# EasyEDA Pro project ProPrj_英才杯B题_2024-11-06.epro, board PCB1
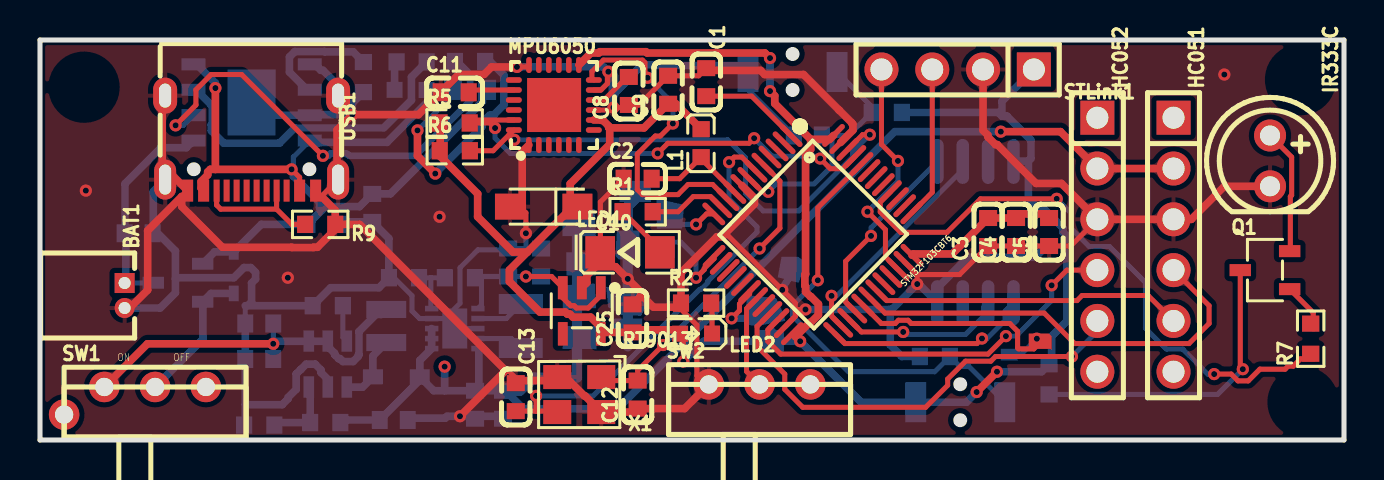
[diagram p1: board, top side]
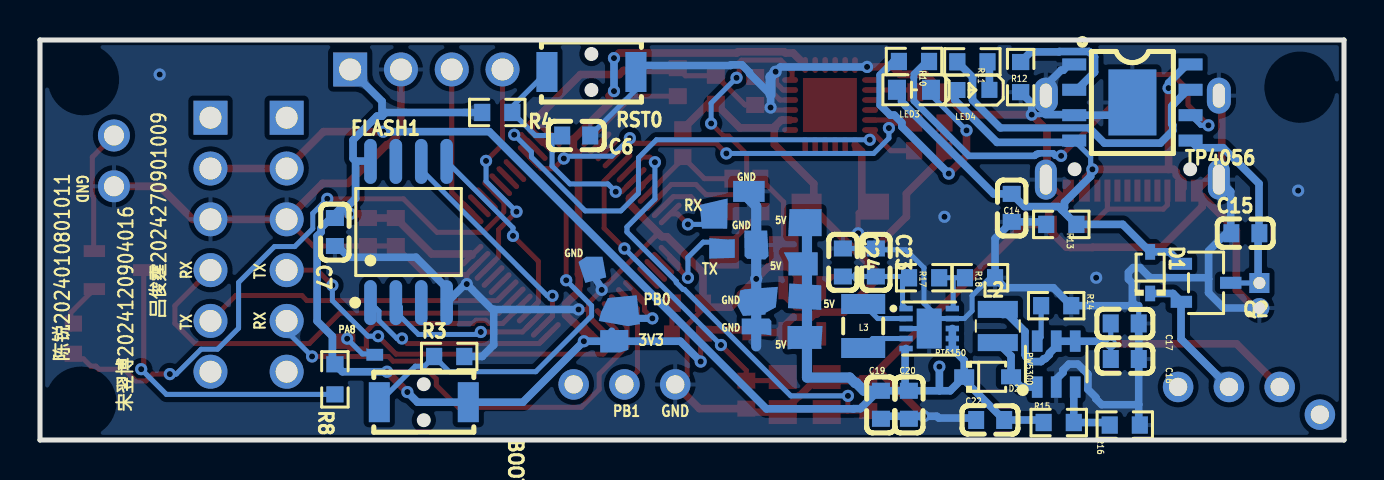
[diagram p2: board, bottom side, seen from below]

Outline 65.21 x 20 mm; copper layers: Top Layer, Bottom Layer. Coordinates in mm from the lower left corner of the outline.
Outline path: 0,20 0,0 65.21,0 65.21,20 0,20
Stack: Top Layer 0.035mm / Dielectric1 1.51mm FR4 er 4.5 / Bottom Layer 0.035mm

## Design rules (mm)
template: JLCPCB Capability(Two Layers Board)
spacing copperThickness1oz (default): track to track 0.102, other pairs 0.152 to 0.3
spacing copperThickness2oz: track to track 0.203, other pairs 0.152 to 0.3
track width copperThickness1oz (default): min 0.127, default 0.254, max 2.54
track width copperThickness2oz: min 0.203, default 0.254, max 2.54
differential pair differentialPair (default): width min 0.127, default 0.254, max 2.54; gap min 0.152, default 0.152
via viaSize (default): diameter min 0.5, default 0.61, max 10; hole min 0.3, default 0.305, max 6.3

## Placement (name value [footprint] x y rotation side)
BAT1  HC-1.25-2AW  [CONN-TH_2P-P1.25_HCTL_HC-1.25-2AW]  4.23 7.22 270 top
BOOT0  ZX-QC34-2TPDZ  [KEY-SMD_L3.9-W3.0-LS5.0-EH]  46.02 1.89 180 bottom
C1  100nF  [C0603]  33.32 17.89 270 top
C2  100nF  [C0603]  29.89 13.07 0 top
C3  100nF  [C0603]  47.41 10.4 90 top
C4  100nF  [C0603]  48.81 10.4 90 top
C5  100nF  [C0603]  50.46 10.4 90 top
C6  100nF  [C0603]  38.39 15.22 0 bottom
C7  100nF  [C0603]  50.46 10.4 90 bottom
C8  100nF  [C0603]  29.44 17.45 90 top
C9  10nF  [C0603]  31.41 17.51 90 top
C10  100nF  [CAP-SMD_L3.2-W1.6-RD]  25.19 11.67 180 top
C11  2.2uF  [C0603]  20.74 17.38 0 top
C12  12pF  [C0603]  29.89 2.27 90 top
C13  12pF  [C0603]  23.79 2.14 270 top
C14  10uF  [C0603]  16.62 11.61 90 bottom
C15  10uF  [C0603]  4.93 10.34 180 bottom
C16  100nF  [C0603]  10.96 4.05 0 bottom
C17  22uF  [C0603]  10.97 5.83 0 bottom
C19  100nF  [C0603]  23.16 1.76 90 bottom
C20  22uF  [C0603]  21.76 1.76 90 bottom
C22  10uF  [C0603]  17.69 1 180 bottom
C23  22uF  [C0603]  23.41 8.88 270 bottom
C24  1uF  [C0603]  25.06 8.88 270 bottom
C25  1uF  [C0603]  29.63 6.08 90 top
D1  B5817WS  [SOD-323_L1.7-W1.3-LS2.5-FD]  9.69 8.37 270 bottom
D2  1N5819WS  [SOD-323_L1.8-W1.3-LS2.5-RD]  17.82 3.16 180 bottom
FLASH1  W25Q16JVSSIQ  [SOIC-8_L5.3-W5.3-P1.27-LS8.0-BL]  46.78 10.4 180 bottom
HC051  PZ254V-11-06P  [HDR-TH_6P-P2.54-V-M]  56.68 9.76 270 top
HC052  PZ254V-11-06P  [HDR-TH_6P-P2.54-V-M]  52.87 9.76 270 top
IR333C  IR333C-A(BY)(Q)  [LED-TH_BD5.0-P2.54-FD]  61.51 13.95 270 top
L1  CBG160808U000T  [L0603]  33.06 14.84 90 top
L2  3.3uH  [IND-SMD_L2.5-W2.0-VLS252012CX-150M]  17.31 5.7 270 bottom
L3  2.2uH  [IND-SMD_L2.5-W2.0_MHCHL2520]  24.04 5.7 90 bottom
LED1  NCD1206R1  [LED1206-R-RD_RED]  29.51 9.38 0 top
LED2  NCD0603R1  [LED0603-RD_RED]  32.81 5.32 180 top
LED3  NCD0603G1  [led0603-rd_1]  21.5 17.51 0 bottom
LED4  NCD0603R1  [LED0603-RD_RED]  18.53 17.5 0 bottom
MPU6050  MPU-6050  [QFN-24_L4.0-W4.0-P0.50-BL-EP2.7]  25.7 16.75 0 top
NOREF  -  [Pad_e13908]  26.96 10.87 0 top
NOREF#2  -  [Pad_e95]  37.59 8.56 0 top
NOREF#3  -  [Pad_e96]  36.24 6.46 0 top
NOREF#4  -  [Pad_e13905]  27.17 8.8 0 top
NOREF#5  -  [Pad_e13907]  26.95 5.13 0 top
NOREF#6  -  [Pad_e13909]  29.32 6.91 0 top
NOREF#7  -  [Pad_e13888]  31.5 11.32 0 top
NOREF#8  -  [Pad_e164]  1.21 1.27 0 top
NOREF#9  -  [Pad_e13910]  29.38 5.68 0 top
NOREF#10  -  [Pad_e13924]  29.76 12.43 0 top
NOREF#11  -  [Pad_e13889]  31.1 9.57 0 top
NOREF#12  -  [Pad_e13922]  29.39 9.75 0 top
NOREF#13  -  [Pad_e575]  49.96 4.94 0 top
NOREF#14  -  [Pad_e97]  36.49 4.94 0 top
NOREF#15  -  [Pad_e881]  48.47 4.26 0 top
NOREF#16  -  [Pad_e13906]  26.97 7.17 0 top
PW5300  PW5300  [SOT-23-6_L2.9-W1.6-P0.95-LS2.8-BL]  14.39 3.8 180 bottom
Q1  S8050  [SOT-23-3_L2.9-W1.6-P1.90-LS2.8-BR]  61.26 8.49 0 top
Q2  CJ3401  [SOT-23-3_L2.9-W1.6-P1.90-LS2.8-BR]  6.9 7.86 0 bottom
R1  470Ω  [R0603]  29.89 11.41 0 top
R2  4.7kΩ  [R0603]  32.81 6.84 0 top
R3  10kΩ  [R0603]  44.74 4.18 180 bottom
R4  10kΩ  [R0603]  42.34 16.38 0 bottom
R5  4.7kΩ  [R0603]  20.73 15.85 0 top
R6  4.7kΩ  [R0603]  20.74 14.46 0 top
R7  1kΩ  [R0603]  63.54 5.06 90 top
R8  100Ω  [R0603]  50.46 3.03 90 bottom
R9  5.1kΩ  [R0603]  14.01 10.78 180 top
R10  4.7kΩ  [R0603]  21.5 18.93 0 bottom
R11  4.7kΩ  [R0603]  18.58 18.91 180 bottom
R12  4.7kΩ  [R0603]  16.17 18.15 90 bottom
R13  10kΩ  [R0603]  14.14 10.78 180 bottom
R14  30kΩ  [R0603]  14.39 6.72 0 bottom
R15  88K  [R0603]  14.27 0.87 0 bottom
R16  12kΩ  [R0603]  10.96 0.75 0 bottom
R17  487kΩ  [R0603]  21 8.11 0 bottom
R18  86.6kΩ  [R0603]  18.2 8.11 0 bottom
RST0  ZX-QC34-2TPDZ  [KEY-SMD_L3.9-W3.0-LS5.0-EH]  37.63 18.4 180 bottom
RT6150  RT6150BGQW  [WSON-10_L2.5-W2.5-P0.50-BL-EP]  20.74 5.57 270 bottom
RT9013  RT9013-33GB  [SOT-23-5_L3.0-W1.7-P0.95-LS2.8-BL]  27.09 6.46 180 top
STLink1  PZ254V-11-04P  [HDR-TH_4P-P2.54-V-M]  45.89 18.53 180 top
STM32F103CBT6  STM32F103CBT6  [LQFP-48_L7.0-W7.0-P0.50-LS9.0-BL]  38.65 10.27 225.3 top
SW1  TA-3522-A3  [SW-TH_3P-L9.1-W3.5-P2.50-A3]  5.76 2.65 0 top
SW2  TA-3522-A3  [SW-TH_3P-L9.1-W3.5-P2.50-A3]  35.98 2.78 0 top
TP4056  TP4056-42-ESOP8  [ESOP-8_L4.9-W3.9-P1.27-LS6.0-BL-EP]  10.58 16.88 270 bottom
USB1  TYPE-C 16PIN 2MD(073)  [USB-C-SMD_TYPE-C-6PIN-2MD-073]  10.58 14.84 180 top
X1  8MHz  [OSC-SMD_4P-L3.2-W2.5-BL]  26.96 2.27 180 top

## Footprints (pads in the part's own frame, mm; a bottom-side part is the same pattern mirrored in y, then rotated)
C0603
  rect 0.8x0.9 smd: 1(-0.7,0) 2(0.7,0)
CAP-SMD_L3.2-W1.6-RD
  rect 1.5x1.296 smd: 1(-1.687,0) 2(1.687,0)
CONN-TH_2P-P1.25_HCTL_HC-1.25-2AW
  rect 1x1 hole 0.6: 1(-0.625,0)
  round 1 hole 0.6: 2(0.625,0)
ESOP-8_L4.9-W3.9-P1.27-LS6.0-BL-EP
  rect 0.6x1.2 smd: 1(-1.905,-2.909) 2(-0.635,-2.909) 3(0.635,-2.909) 4(1.905,-2.909) 5(1.905,2.909) 6(0.635,2.909) 7(-0.635,2.909) 8(-1.905,2.909)
  rect 3.3x2.4 smd: 9(0,0)
HDR-TH_4P-P2.54-V-M
  rect 1.7x1.7 hole 1.1: 1(-3.81,0)
  round 1.7 hole 1.1: 2(-1.27,0) 3(1.27,0) 4(3.81,0)
HDR-TH_6P-P2.54-V-M
  rect 1.7x1.7 hole 1.1: 1(-6.35,0)
  round 1.7 hole 1.1: 2(-3.81,0) 3(-1.27,0) 4(1.27,0) 5(3.81,0) 6(6.35,0)
IND-SMD_L2.5-W2.0-VLS252012CX-150M
  rect 0.85x2 smd: 1(-0.83,0) 2(0.83,0)
IND-SMD_L2.5-W2.0_MHCHL2520
  rect 1x2.2 smd: 1(-1.1,0) 2(1.1,0)
KEY-SMD_L3.9-W3.0-LS5.0-EH
  rect 1.05x2 smd: 1(-2.225,0) 2(2.225,0)
L0603
  rect 0.8x0.864 smd: 1(-0.7,0) 2(0.7,0)
led0603-rd_1
  rect 0.9x1 smd: 1(-0.85,0) 2(0.85,0)
LED0603-RD_RED
  rect 0.8x0.8 smd: 1(-0.799,-0.004) 2(0.799,0.004)
LED1206-R-RD_RED
  rect 1.485x1.62 smd: 1(1.492,0) 2(-1.492,0)
LED-TH_BD5.0-P2.54-FD
  round 1.6 hole 1: 1(-1.27,0) 2(1.27,0)
LQFP-48_L7.0-W7.0-P0.50-LS9.0-BL
  oval 0.27x1.5 smd: 1(-2.75,-4.25) 2(-2.25,-4.25) 3(-1.75,-4.25) 4(-1.25,-4.25) 5(-0.75,-4.25) 6(-0.25,-4.25) 7(0.25,-4.25) 8(0.75,-4.25) 9(1.25,-4.25) 10(1.75,-4.25) 11(2.25,-4.25) 12(2.75,-4.25) 25(2.75,4.25) 26(2.25,4.25) 27(1.75,4.25) 28(1.25,4.25) 29(0.75,4.25) 30(0.25,4.25) 31(-0.25,4.25) 32(-0.75,4.25) 33(-1.25,4.25) 34(-1.75,4.25) 35(-2.25,4.25) 36(-2.75,4.25)
  oval 1.5x0.27 smd: 13(4.25,-2.75) 14(4.25,-2.25) 15(4.25,-1.75) 16(4.25,-1.25) 17(4.25,-0.75) 18(4.25,-0.25) 19(4.25,0.25) 20(4.25,0.75) 21(4.25,1.25) 22(4.25,1.75) 23(4.25,2.25) 24(4.25,2.75) 37(-4.25,2.75) 38(-4.25,2.25) 39(-4.25,1.75) 40(-4.25,1.25) 41(-4.25,0.75) 42(-4.25,0.25) 43(-4.25,-0.25) 44(-4.25,-0.75) 45(-4.25,-1.25) 46(-4.25,-1.75) 47(-4.25,-2.25) 48(-4.25,-2.75)
OSC-SMD_4P-L3.2-W2.5-BL
  rect 1.4x1.2 smd: 1(-1.1,-0.875) 2(1.1,-0.875) 3(1.1,0.875) 4(-1.1,0.875)
Pad_e95
  custom 1.39x1.308 smd far side: 1(0,0)
Pad_e96
  custom 2.058x1.543 smd far side: 58(0,0)
Pad_e97
  custom 1.406x1.124 smd far side: 59(0,0)
Pad_e164
  round 1.524 hole 0.914: 2(0,0)
Pad_e575
  custom 1.252x0.818 smd: 60(0,0)
Pad_e881
  custom 0.838x0.645 smd far side: 1(0,0)
Pad_e13888
  custom 1.392x1.51 smd far side: 1(0,0)
Pad_e13889
  custom 1.275x1.024 smd far side: 49(0,0)
Pad_e13905
  custom 1.694x1.157 smd far side: 50(0,0)
Pad_e13906
  custom 1.663x1.321 smd far side: 51(0,0)
Pad_e13907
  custom 1.748x1.169 smd far side: 52(0,0)
Pad_e13908
  custom 1.665x1.349 smd far side: 53(0,0)
Pad_e13909
  custom 2.018x1.451 smd far side: 54(0,0)
Pad_e13910
  custom 1.48x0.843 smd far side: 55(0,0)
Pad_e13922
  custom 1.214x1.444 smd far side: 56(0,0)
Pad_e13924
  custom 1.575x1.052 smd far side: 57(0,0)
QFN-24_L4.0-W4.0-P0.50-BL-EP2.7
  oval 0.28x0.8 smd: 1(-1.25,-2) 2(-0.75,-2) 3(-0.25,-2) 4(0.25,-2) 5(0.75,-2) 6(1.25,-2) 13(1.25,2) 14(0.75,2) 15(0.25,2) 16(-0.25,2) 17(-0.75,2) 18(-1.242,2)
  oval 0.8x0.28 smd: 7(2,-1.25) 8(2,-0.75) 9(2,-0.25) 10(2,0.25) 11(2,0.75) 12(2,1.25) 19(-2,1.25) 20(-2,0.75) 21(-2,0.25) 22(-2,-0.25) 23(-2,-0.75) 24(-2,-1.25)
  rect 2.7x2.7 smd: 25(0.013,0)
R0603
  rect 0.806x0.864 smd: 1(-0.753,0) 2(0.753,0)
SOD-323_L1.7-W1.3-LS2.5-FD
  rect 0.78x0.5 smd: 1(-1.04,0) 2(1.04,0)
SOD-323_L1.8-W1.3-LS2.5-RD
  rect 1x0.75 smd: 1(-1.173,0) 2(1.173,0)
SOIC-8_L5.3-W5.3-P1.27-LS8.0-BL
  oval 0.63x2.25 smd: 1(-1.905,-3.53) 2(-0.635,-3.53) 3(0.635,-3.53) 4(1.905,-3.53) 5(1.905,3.53) 6(0.635,3.53) 7(-0.635,3.53) 8(-1.905,3.53)
SOT-23-3_L2.9-W1.6-P1.90-LS2.8-BR
  rect 1.07x0.6 smd: 1(1.235,-0.95) 2(1.235,0.95) 3(-1.235,0)
SOT-23-5_L3.0-W1.7-P0.95-LS2.8-BL
  rect 0.49x1.157 smd: 1(-0.95,-1.153) 2(0,-1.153) 3(0.95,-1.153)
  rect 0.49x1.175 smd: 4(0.95,1.153) 5(-0.95,1.153)
SOT-23-6_L2.9-W1.6-P0.95-LS2.8-BL
  rect 0.532x1.072 smd: 1(-0.95,-1.149) 2(0,-1.149) 3(0.95,-1.149) 4(0.95,1.149) 5(0,1.149) 6(-0.95,1.149)
SW-TH_3P-L9.1-W3.5-P2.50-A3
  round 1.524 hole 0.914: 1(-2.54,0) 2(0,0) 3(2.54,0)
USB-C-SMD_TYPE-C-6PIN-2MD-073
  rect 0.55x1.1 smd: 1(-3.2,2.375) 2(-2.4,2.375) 11(2.4,2.375) 12(3.2,2.375)
  rect 0.3x1.1 smd: 3(-1.75,2.375) 4(-1.25,2.375) 5(-0.75,2.375) 6(-0.25,2.375) 7(0.25,2.375) 8(0.75,2.375) 9(1.25,2.375) 10(1.75,2.375)
  oval 1.1x2 hole 0.6x1.5: 13(-4.325,1.825) 14(4.325,1.825)
  oval 1.2x1.8 hole 0.6x1.2: 13(-4.325,-2.375) 14(4.325,-2.375)
WSON-10_L2.5-W2.5-P0.50-BL-EP
  rect 0.28x0.665 smd: 1(-1,-1.157) 2(-0.5,-1.157) 3(0,-1.157) 4(0.5,-1.157) 5(1,-1.157) 6(1,1.157) 7(0.5,1.157) 8(0,1.157) 9(-0.5,1.157) 10(-1,1.157)
  rect 2x1.25 smd: 11(0,0)

## Nets
As in the schematic, except:
3V3: BOOT0.2 C3.2 C4.2 C5.2 C7.2 C9.1 C10.1 C25.1 FLASH1.8 L1.2 LED2.2 MPU6050.8 MPU6050.13 NOREF#14.59 R4.2 R5.1 R6.1 R8.2 RT9013.5 STLink1.1 STM32F103CBT6.24 STM32F103CBT6.36 STM32F103CBT6.48
+5V: C19.2 C20.2 C22.2 D2.1 HC051.2 HC052.2 NOREF.53 NOREF#4.50 NOREF#5.52 NOREF#16.51 R15.2 RT6150.5 RT6150.6 RT6150.7 RT6150.8
GND: BAT1.2 C1.1 C2.1 C3.1 C4.1 C5.1 C6.1 C7.1 C8.1 C9.2 C10.2 C11.1 C12.1 C13.1 C14.1 C15.1 C16.1 C17.1 C19.1 C20.1 C22.1 C23.1 C24.1 C25.2 FLASH1.4 HC051.3 HC052.3 IR333C.2 LED1.2 MPU6050.1 MPU6050.9 MPU6050.11 MPU6050.18 NOREF#2.1 NOREF#6.54 NOREF#9.55 NOREF#10.57 NOREF#12.56 PW5300.2 R2.1 R3.2 R9.1 R12.1 R13.1 R14.1 R16.1 R18.1 RST0.2 RT6150.3 RT6150.9 RT6150.11 RT9013.2 STLink1.2 STM32F103CBT6.8 STM32F103CBT6.23 STM32F103CBT6.35 STM32F103CBT6.47 SW2.1 TP4056.1 TP4056.3 TP4056.9 USB1.1 USB1.12 USB1.13 USB1.14 X1.2 X1.4
DIN_2812B: NOREF#13.60 NOREF#15.1 STM32F103CBT6.29
USART2_RX: NOREF#11.49 STM32F103CBT6.13
USART2_TX: NOREF#7.1 STM32F103CBT6.12
USER_BUTTON: NOREF#3.58 STM32F103CBT6.18

Pads without a net: FLASH1 3 7; HC051 1 6; HC052 1 6; MPU6050 2 3 4 5 6 7 14 15 16 17 19 21 22 25; NOREF#8 2; RT9013 4; STM32F103CBT6 2 3 4 14 15 16 17 20 32 33 38 39 41 42 43; SW1 3; SW2 3; USB1 3 5 6 7 8 9

## Via types
v1: diameter 0.61, hole 0.305, Top Layer to Bottom Layer, 61 vias

## Routing (per net, layer and track width the routed paths; a pad name or vN(x,y) marks a point on that pad's centre or on a via; arc(x,y) is an arc through that point)
3V3: length 116.3
  Top Layer w0.249: 37.62,5.32 37.77,5.16 38,4.94 v1(38.01,4.94) ; v1(32.17,3.92) 32.17,5.15 32.04,5.29
  Top Layer w0.254: 28.3,5.38 28.11,5.38 RT9013.5
  Top Layer w0.381: v1(36.51,17.44) 36.74,17.21 36.74,16.83 38.54,15.03 ; 28.46,15.61 30.2,15.61 C9.1 31.79,16.81 L1.2 ; 28.46,15.61 28.49,15.57 28.49,14.79 26.51,12.81 26.51,11.54 24.37,9.4 ; 28.46,15.61 28.44,15.63 28.44,15.7 28.16,15.98 28.08,15.98 28.06,16 MPU6050.8 ; LED2.2 32.01,5.44 31.94,5.51 29.76,5.51 C25.1 28.3,5.38 27.54,6.14 26.65,6.14 26.5,6.3 26.37,6.3 26.27,6.4 25,6.4 23.47,7.92 23.47,8.5 24.37,9.4 ; C5.2 50.25,11.3 v1(49.69,11.3) 49.02,11.3 C4.2 C3.2 45.62,9.3 43.67,9.3 43.61,9.24 ; STM32F103CBT6.48 39.48,15.03 38.54,15.03 ; 38.54,15.03 38.54,14.52 38.28,14.27 38.28,8.29 38.25,8.25 38.25,7.72 38.28,7.68 38.28,7.41 38.52,7.17 38.55,7.17 38.92,6.79 38.92,6.26 38.55,5.88 38.5,5.88 37.77,5.16 ; v1(46.84,2.4) v1(47.85,3.41) ; 24.37,9.4 23.65,9.4 21.89,11.16 21.89,12.31 20.02,14.18 20.02,15.82 R5.1 ; v1(36.51,19.09) 36.25,19.35 30.36,19.35 30.3,19.41 28,19.41 27.93,19.35 27.55,19.35 MPU6050.13
  Bottom Layer w0.254: 49.94,11.56 v1(49.69,11.3)
  Bottom Layer w0.381: 48.1,16.19 48.36,16.19 49.55,15 49.55,14.07 49.43,13.95 ; 48.1,16.19 48.1,16.93 STLink1.1 ; 48.1,16.19 47.92,16.38 R4.2 ; 49.43,13.95 48.7,13.95 FLASH1.8 ; 49.43,13.95 49.43,12.08 49.94,11.56 50.2,11.56 51.15,10.61 51.15,10.4 51.35,10.2 51.35,5.95 50.59,5.18 50.59,3.91 R8.2 50.09,3.41 v1(47.85,3.41) ; v1(36.51,17.44) v1(36.51,19.09) ; v1(46.84,2.4) 46.33,1.89 BOOT0.2 41.06,1.89 v1(38.01,4.94) NOREF#14.59 33.19,4.94 v1(32.17,3.92)
+5V: length 67.9
  Top Layer w0.381: HC051.2 HC052.2 51.03,15.42 v1(48.05,15.42)
  Bottom Layer w0.254: 21.95,2.46 C20.2 ; 19.2,2.96 D2.1
  Bottom Layer w0.381: 20.23,2.46 v1(20.23,3.67) ; 20.23,2.46 C20.2 ; 20.23,2.46 19.69,2.46 19.2,2.96 18.95,2.96 C22.2 15.15,1 R15.2 ; D2.1 18.99,3.98 RT6150.6 RT6150.7 RT6150.8 ; v1(48.05,15.42) 42.74,15.42 28.88,1.56 24.54,1.56 24.53,1.56 24.18,1.56 23.28,2.46 C19.2 21.95,2.46 21.95,4.52 RT6150.5
  Bottom Layer w0.508: 23.28,2.46 24,2.46 24.39,2.85 24.45,2.85 24.72,3.12 26.85,3.12 26.85,11.29
GND: length 265.5
  Top Layer w0.249: 37.77,6.53 37.77,6.18 STM32F103CBT6.23 ; 37.77,6.53 v1(38.28,6.53) ; 37.77,6.53 37.77,6.85 v1(37.12,7.51) 34.42,10.21 34.15,10.21 ; v1(43.87,7.8) 43.87,8.27 STM32F103CBT6.35
  Top Layer w0.252: 23.92,2.97 23.41,3.47 23.29,3.47 ; C8.1 29.31,16.62 v1(28.67,16.62) 28.55,16.5 MPU6050.9 ; MPU6050.18 24.36,18.65 v1(23.85,18.65)
  Top Layer w0.254: 43.87,8.27 45.98,8.27 C3.1 C4.1 C5.1 51.54,9.7 HC052.3 ; LED1.2 28.02,9.37 28.02,11.9 C2.1 ; 7.09,12.18 USB1.12 ; C1.1 32.93,18.21 C9.2 29.95,16.75 C8.1 ; v1(28.42,18.41) 28.37,18.37 28.37,17.83 28.05,17.5 MPU6050.11 ; X1.2 25.74,3.15 25.56,2.97 ; USB1.1 14.09,12.16 14.09,12.2 14.85,12.97 USB1.13 ; v1(24.3,10.34) 24.3,11.36 24.11,11.54 ; R2.1 32,6.59 32.85,5.74 32.85,3.2 33.36,2.69 SW2.1
  Top Layer w0.381: MPU6050.1 24.11,14.42 24.11,11.54 ; v1(21,1.19) 23.29,3.47 15.98,10.78 R9.1 ; 30.19,7.13 30.68,6.64 31.95,6.64 32,6.59 ; 30.19,7.13 29.98,7.13 C25.2 ; 30.19,7.13 30.19,7.26 v1(29.39,8.05) 28.78,8.66 27.78,8.66 27.35,8.23 27.35,7.87 RT9013.2 ; BAT1.2 4.49,6.6 5.38,7.5 5.38,10.47 7.09,12.18 7.09,11.67 9.12,9.64 12.57,9.64 12.59,9.62 13.68,9.62 13.69,9.64 13.88,9.64 14.76,10.53 R9.1 ; 33.36,2.69 32.23,1.57 C12.1 29.71,1.4 28.07,1.4 27.26,2.2 27.22,2.2 26.39,3.03 25.98,3.03 X1.2 ; STLink1.2 47.16,15.48 47.4,15.24 47.4,15.15 47.78,14.77 47.87,14.77 49.81,12.83 51.08,12.83 HC052.3 HC051.3 57.57,11.03 59.22,12.69 IR333C.2 ; USB1.14 6.11,17.07 6.11,13.74 USB1.12 ; R9.1 14.76,11.49 14.09,12.16 ; 39.96,16.49 40.59,15.86 40.59,15.85 40.65,15.79 40.65,15.49 STM32F103CBT6.47 ; 39.96,16.49 38.18,18.27 36.24,18.27 36.03,18.48 33.2,18.48 ; 39.96,16.49 39.95,16.49 ; 14.85,12.97 14.85,15.51 v1(15.62,16.27) 18.92,16.27 C11.1 20.94,18.28 22.21,18.28 22.58,18.65 v1(23.85,18.65) ; 23.92,2.97 25.56,2.97 ; 35.1,12.73 35.73,12.1 35.73,11.8 35.1,11.17 35.1,11.16 34.15,10.21 34.1,10.16 33.85,10.16 32.05,8.37 R2.1
  Bottom Layer w0.249: 44.78,6.96 FLASH1.4
  Bottom Layer w0.252: C23.1 23.35,9.51 21.9,9.51 21,8.61 21,6.83 20.24,6.07 ; 20.24,6.07 RT6150.9 18.98,6.07 18.6,6.45 18.6,7.22 17.7,8.11 R18.1 ; 20.24,6.07 RT6150.11 RT6150.3
  Bottom Layer w0.254: 24.3,9.58 v1(24.3,10.34) ; 24.3,9.58 C23.1 ; 24.3,9.58 C24.1 ; RST0.2 35.41,17.51 C6.1 ; 21.76,1.19 C20.1 ; USB1.13 14.92,17.21 14.92,16.27 v1(15.62,16.27) ; 10.27,6.72 C17.1
  Bottom Layer w0.355: 37.86,8.7 37.13,7.61
  Bottom Layer w0.381: 6.77,8.06 6.77,9.45 5.67,10.56 5.67,12.43 USB1.14 ; 6.77,8.06 6.83,8.11 9.69,8.11 10.2,8.62 10.54,8.62 10.78,8.38 10.78,8.04 10.58,7.84 10.58,6.9 10.39,6.72 ; 6.77,8.06 6.77,7.36 6.01,6.6 BAT1.2 ; 14.92,16.27 13.52,16.27 13.49,16.24 11.22,16.24 TP4056.9 ; 42.52,6.53 42.52,4.75 43.09,4.18 R3.2 ; 42.52,6.53 v1(38.28,6.53) ; 42.52,6.53 42.6,6.53 v1(43.87,7.8) 43.94,7.8 44.78,6.96 44.78,7.52 46.4,9.14 49.77,9.14 50.33,9.7 C5.1 ; v1(23.85,18.65) 28.18,18.65 v1(28.42,18.41) ; R12.1 15.62,16.84 v1(15.62,16.27) ; RST0.2 35.08,18.73 30.68,18.73 30.64,18.76 30.11,18.76 29.73,18.38 29.73,18.33 28.67,17.27 v1(28.67,16.62) ; C22.1 18.49,1.1 20.27,1.1 20.36,1.19 v1(21,1.19) 23.03,1.19 C19.1 ; 10.27,1.77 10.27,0.8 R16.1 ; 10.27,1.77 12.11,1.77 12.41,2.06 12.41,2.13 12.81,2.53 12.81,3.29 12.83,3.32 12.83,3.32 13.03,3.52 13.04,3.52 13.31,3.8 13.76,3.8 14.05,3.5 14.05,3.37 14.39,3.03 PW5300.2 ; 10.27,1.77 C17.1 ; 10.39,6.72 10.27,6.72 ; 10.39,6.72 R14.1 14.54,7.61 16.95,7.61 R18.1 17.45,10.07 C14.1 15.02,10.91 R13.1 ; TP4056.1 13.74,18.78 14.04,18.49 14.15,18.49 15.04,17.59 15.04,17.34 14.92,17.21
  Bottom Layer w0.508: v1(28.42,18.41) 28.67,18.16 28.67,17.27 ; 30.27,12.56 29.39,11.68 v1(29.39,8.05) 29.39,4.68
  vias: v1(2.29,12.47) v1(12.39,8.11) v1(19.98,11.16) v1(59.22,18.27)
VBAT_E: length 5.1
  Top Layer w0.249: C1.2 35.58,17.19 STM32F103CBT6.1
VCC_USB: length 42.4
  Top Layer w0.254: USB1.2 12.98,13.13 v1(12.58,13.53)
  Top Layer w0.381: 8.77,13.53 8.52,13.53 8.38,13.4 8.38,13.25 8.05,12.92 8.05,12.6 USB1.11 ; 8.77,13.53 v1(8.77,17.6) ; 8.77,13.53 v1(12.58,13.53)
  Bottom Layer w0.254: v1(12.58,13.53) 12.67,13.44 12.67,14.15 TP4056.4
  Bottom Layer w0.381: 14.11,11.5 14.27,11.67 15.98,11.67 C14.2 17.52,12.31 21.93,16.72 21.93,16.73 22.12,16.92 22.12,17.28 LED3.2 ; 14.11,11.5 R13.2 11.07,10.78 D1.1 8.73,9.41 Q2.1 ; 14.11,11.5 13.98,11.63 13.98,11.88 12.67,13.19 12.67,13.44 ; 19.33,17.5 19.46,17.37 19.46,16.99 17.35,14.88 13.9,14.88 13.87,14.84 13.62,14.84 TP4056.4 ; v1(8.77,17.6) 8.77,17.85 7.87,18.75 7.71,18.75 TP4056.8
BOOT0: length 22.1
  Top Layer w0.249: STM32F103CBT6.44 38.89,11.61 v1(38.89,7.99)
  Bottom Layer w0.249: R3.1 44.74,3.41 40.42,3.41 37.62,6.21 37.62,6.72 v1(38.89,7.99)
  Bottom Layer w0.254: R3.1 45.99,3.69 46.44,3.69 BOOT0.1
DIN_2812B: length 12.3
  Top Layer w0.254: STM32F103CBT6.29 42.07,5.83 42.76,5.83 42.92,5.99 43.41,5.99 43.57,5.83 48.49,5.83 48.89,5.43 48.89,4.61 48.94,4.56 49.7,4.56 49.85,4.71 v1(49.85,5.06)
  Bottom Layer w0.254: v1(49.85,5.06) 49.08,4.3 48.55,4.3
EXIT0_6050: length 16.4
  Top Layer w0.249: MPU6050.12 27.6,18.09 27.6,18.42 28.17,19 30.13,19 30.25,18.87 30.25,18.24 v1(30.38,18.11) ; v1(31.65,15.83) 31.02,15.2 30.77,15.2 29.87,14.3 29.87,12.52 30.12,12.27 31.9,12.27 32.41,12.78 33.63,12.78 34.4,12.02
  Bottom Layer w0.249: v1(31.65,15.83) 31.65,16.84 v1(30.38,18.11)
I2C1_SCL: length 23.7
  Top Layer w0.249: v1(30.88,14.33) 31.39,14.84 35.46,14.84 v1(35.71,15.09) ; v1(39.01,14.07) 39.52,13.57 40.14,13.57 STM32F103CBT6.45 ; v1(22.76,15.6) 22.5,15.85 R5.2
  Top Layer w0.252: MPU6050.23 21.63,16 R5.2
  Bottom Layer w0.249: v1(35.71,15.09) 36.61,14.19 38.89,14.19 v1(39.01,14.07) ; v1(22.76,15.6) 22.76,15.09 23.52,14.33 v1(30.88,14.33)
I2C1_SDA: length 26.4
  Top Layer w0.249: v1(41.49,15.27) 41.13,15.27 40.39,14.52 ; 23.46,15.27 v1(23.71,15.01)
  Top Layer w0.252: MPU6050.24 22.66,14.46 R6.2
  Bottom Layer w0.249: v1(23.71,15.01) 34.38,15.01 35.28,14.11 35.28,12.33 36.16,11.45 37.94,11.45 40.63,14.15 40.63,14.4 v1(41.49,15.27)
IR: length 30
  Top Layer w0.249: STM32F103CBT6.40 42.02,11.91 42.02,11.4 43.03,10.38 45.36,10.38 47.03,12.06 v1(50.84,12.06)
  Top Layer w0.254: 63.67,4.06 63.03,4.06 62.67,3.69 62.41,3.69 62.26,3.54 61,3.54 60.42,2.96 59.91,2.96 59.57,3.3 v1(58.71,3.3)
  Bottom Layer w0.249: v1(58.71,3.3) 58.39,3.3 57.15,4.54 56.33,4.54 55.28,5.59 55.28,7.88 53.48,9.67 52.46,9.67 51.57,10.57 51.57,11.33 v1(50.84,12.06)
NRST: length 12.2
  Top Layer w0.249: v1(36.42,12.41) 36.12,12.41 STM32F103CBT6.7
  Bottom Layer w0.249: v1(36.42,12.41) 36.81,12.8 38.7,12.8 39.6,13.7 39.6,15.22
  Bottom Layer w0.254: RST0.1 41.59,16.67 41.59,16.38 40.44,15.22 C6.2
OSC_IN: length 16
  Top Layer w0.249: v1(31.16,4.75) 29.89,3.48 C12.2 ; v1(35.98,9.58) 37,10.59 37,12.95 STM32F103CBT6.5
  Top Layer w0.254: C12.2 28.24,2.97 28.07,3.15
  Bottom Layer w0.249: v1(31.16,4.75) v1(35.98,9.58)
OSC_OUT: length 23
  Top Layer w0.249: 24.81,1.44 v1(24.81,2.21) ; STM32F103CBT6.6 35.1,14.14 34.71,14.14 v1(34.46,13.89)
  Top Layer w0.254: 23.92,1.44 25.82,1.44 X1.3
  Bottom Layer w0.254: v1(34.46,13.89) 34.46,12.05 35.86,10.65 35.86,10.4 33.39,7.94 33.39,7.87 33.05,7.53 32.98,7.53 27.66,2.21 v1(24.81,2.21)
PA1_LED: length 3.9
  Top Layer w0.249: 34.05,11.66 33.54,12.17 32.66,12.17 31.91,11.41 R1.2
PB1: length 4.8
  Top Layer w0.249: SW2.2 35.33,3.43 35.33,6.57 35.84,7.07
SPI2_MISO: length 8.2
  Top Layer w0.249: v1(43.16,5.4) 41.08,5.4 STM32F103CBT6.27
  Bottom Layer w0.249: FLASH1.2 47.18,6.64 47.18,6.18 46.28,5.28 43.29,5.28 v1(43.16,5.4)
SPI2_MOSI: length 9.6
  Top Layer w0.249: 40.79,6.4 40.29,6.9 40.29,8.94 v1(41.55,10.21)
  Bottom Layer w0.249: v1(41.55,10.21) 41.55,10.61 FLASH1.5
SPI2_SCK: length 11.3
  Top Layer w0.249: STM32F103CBT6.26 39.58,6.19 v1(39.58,7.21)
  Bottom Layer w0.249: FLASH1.6 46.12,13.91 46.12,13.49 39.84,7.21 v1(39.58,7.21)
SYS_JTCK-SWCLK: length 7.6
  Top Layer w0.249: STLink1.3 44.62,12.39 STM32F103CBT6.37
SYS_JTMS-SWDIO: length 11.6
  Top Layer w0.249: v1(41.38,11.41) 42.28,10.52 42.28,9.16 42.9,8.53 ; v1(42.9,13.95) 42.08,14.78 STLink1.4
  Bottom Layer w0.249: v1(41.38,11.41) 42.9,12.94 v1(42.9,13.95)
USART1_RX: length 15.7
  Top Layer w0.249: HC051.5 55.41,7.22 52.11,7.22 51.86,6.97 42.34,6.97 41.85,7.46
USART1_TX: length 21.7
  Top Layer w0.249: STM32F103CBT6.30 42.26,6.34 50.22,6.34 51.74,4.82 57.45,4.82 58.46,5.83 58.46,6.72 HC051.4
USART2_RX: length 4.6
  Top Layer w0.254: v1(32.81,8.11) 33.21,8.52 33.21,8.58 33.71,9.07 STM32F103CBT6.13
  Bottom Layer w0.254: 31.03,9.76 31.16,9.89 32.05,9.89 32.81,9.13 v1(32.81,8.11)
USART2_TX: length 3
  Top Layer w0.254: STM32F103CBT6.12 33.33,11.3 v1(32.81,10.78)
  Bottom Layer w0.254: v1(32.81,10.78) 31.28,10.78 31.03,11.03
USART3_RX: length 20.2
  Top Layer w0.249: HC052.4 51.35,8.49 v1(50.59,7.73) ; 36.91,6.02 36.4,5.51 36.4,4.94 37.04,4.29 47.4,4.29 v1(48.3,5.19)
  Bottom Layer w0.249: v1(50.59,7.73) 50.59,6.97 48.81,5.19 v1(48.3,5.19)
USART3_TX: length 23
  Top Layer w0.249: STM32F103CBT6.21 35.86,5.68 35.86,4.68 37.24,3.3 37.24,2.53 38.14,1.64 44.29,1.64 45.39,2.74 45.39,3.05 46.28,3.94 47.55,3.94 47.78,4.18 v1(51.6,4.18)
  Bottom Layer w0.249: v1(51.6,4.18) 52.87,5.45 HC052.5
USER_BUTTON: length 3.7
  Top Layer w0.254: STM32F103CBT6.18 35.48,7.31 34.98,6.8 34.98,6.47 v1(34.58,6.08)
  Bottom Layer w0.355: v1(34.58,6.08) 36.55,6.08
W25Q16_CHIP_SELECT: length 10.3
  Top Layer w0.249: v1(47.1,5.07) 46.85,4.82 40.25,4.82 STM32F103CBT6.25
  Bottom Layer w0.249: v1(47.1,5.07) 47.36,5.07 48.26,5.97 48.26,6.44 FLASH1.1
$1N1001: length 5.4
  Top Layer w0.249: STM32F103CBT6.9 33.06,14.06 L1.1
  Top Layer w0.254: L1.1 31.98,13.07 C2.2
$1N2026: length 2.8
  Top Layer w0.254: LED1.1 31,9.55 R1.1
$1N2257: length 1.5
  Top Layer w0.254: R2.2 33.61,6.8 LED2.1
$1N3506: length 2.2
  Top Layer w0.252: MPU6050.10 28.2,17 29.36,18.15 C8.2
$1N4122: length 2.3
  Top Layer w0.252: C11.2 21.55,17.5 MPU6050.20
$1N5475: length 2.5
  Top Layer w0.254: 63.67,5.56 63.67,6.37 Q1.1
$1N5549: length 5.9
  Top Layer w0.254: 62.52,9.76 62.52,12.17 62.59,12.24 62.59,14.15 IR333C.1
$1N5650: length 15.2
  Top Layer w0.254: v1(60.15,3.54) 60.02,3.67 Q1.3
  Bottom Layer w0.254: R8.1 58.89,2.28 v1(60.15,3.54)
$1N6695: length 6.5
  Top Layer w0.254: 11.83,11.54 USB1.4 ; 11.83,11.54 12.59,10.78 R9.2 ; 11.83,11.54 9.04,11.54 8.83,11.75 USB1.10
$1N7198: length 15.9
  Bottom Layer w0.355: 17.19,15.61 12.74,15.61
  Bottom Layer w0.381: TP4056.7 7.8,17.51 8.56,16.75 8.56,16.74 8.62,16.68 8.62,15.8 8.56,15.75 8.56,15.47 9.18,14.84 11.98,14.84 12.74,15.61 ; 17.19,15.61 18.57,16.99 18.57,18.15 R11.1
$1N7334: length 13
  Top Layer w0.381: v1(19.77,13.32) 18.88,14.21 v1(18.88,15.48)
  Bottom Layer w0.254: v1(18.88,15.48) 20.65,17.26 LED3.1
  Bottom Layer w0.381: R10.2 22.51,18.93 23.19,18.24 23.19,16.75 22.69,16.24 22.49,16.24 22.11,15.87 22.11,15.66 v1(19.77,13.32)
$1N7338: length 22.6
  Top Layer w0.254: v1(14.15,14.21) 10.08,18.27 8.56,18.27 7.8,17.51 7.8,16.75 v1(6.78,15.73)
  Bottom Layer w0.254: v1(6.78,15.73) 7.17,15.73 7.67,16.24
  Bottom Layer w0.33: R10.1 20.88,18.93 21.5,18.3 21.5,18.13 21.51,18.13 21.51,16.96 18.76,14.21 15.47,14.21 15.38,14.3 15.3,14.3 15.27,14.34 14.55,14.34 14.42,14.21 v1(14.15,14.21)
$1N7377: length 1.4
  Bottom Layer w0.381: R11.2 17.73,18.81 LED4.1
$1N7557: length 6.2
  Bottom Layer w0.381: R12.2 15.66,19.41 14.25,19.41 14.23,19.42 12.75,19.42 12.73,19.41 12.73,19.41 12.47,19.15 12.47,18.39 13.35,17.51 TP4056.2
$1N8006: length 10.7
  Bottom Layer w0.254: BAT1.1 5.65,7.85 Q2.3
  Bottom Layer w0.381: TP4056.5 7.32,14.61 6.05,14.61 4.25,12.82 4.25,10.32 4.3,10.27 4.3,7.85
$1N8100: length 7
  Bottom Layer w0.381: D1.2 8.55,7.33 8.15,6.92 8.15,5.04 SW1.2
$1N8818: length 1.9
  Bottom Layer w0.254: R14.2 15.15,5.14 PW5300.6
$1N8927: length 19.2
  Top Layer w0.381: v1(11.66,4.81) 5.38,4.81 SW1.1
  Bottom Layer w0.254: C16.2 v1(11.66,4.81) 11.66,5.82
  Bottom Layer w0.381: 11.66,4.94 14.39,4.94 14.39,4.68 14.73,4.34 14.73,4.27 14.93,4.07 15,4.07 15.15,3.92 15.66,3.92 15.91,4.18 15.91,4.23 15.95,4.27 15.95,5.42 16.81,6.28 17.06,6.28 L2.1
$1N9016: length 3.5
  Bottom Layer w0.381: L2.2 16.65,4.21 D2.2 16.13,2.65 PW5300.1
$1N9241: length 3.6
  Bottom Layer w0.381: R16.2 11.84,0.87 R15.1 13.51,2.58 PW5300.3
$1N9982: length 2.3
  Bottom Layer w0.252: RT6150.4 23.57,5.07 L3.1
$1N9986: length 2.4
  Bottom Layer w0.252: RT6150.2 23.32,6.07 L3.2
$1N10250: length 2.8
  Bottom Layer w0.252: 19.54,8.11 19.54,6.61 RT6150.10
  Bottom Layer w0.254: R18.2 R17.1
$1N10837: length 10.4
  Top Layer w0.254: RT9013.1 28.04,7.23 27.41,6.6 26.83,6.6 26.71,6.72 26.54,6.72 26.44,6.82 26.43,6.82 26.14,7.11 RT9013.3 25.58,8.17 v1(24.3,8.17)
  Bottom Layer w0.252: 22.08,8.17 22.08,6.75 RT6150.1
  Bottom Layer w0.254: R17.2 21.81,8.17 C23.2 v1(24.3,8.17) C24.2

## Copper pours and planes (outline as drawn; the poured copper is in the pictures)
GND on Top Layer: -1.74,22.08 67.1,22.08 67.1,-2.3 -1.74,-2.3
GND on Bottom Layer: -1.74,22.08 67.1,22.08 67.1,-2.3 -1.74,-2.3

Small or netless copper shapes (teardrops, artwork), in the pictures only: 24 on Top Layer, 9 on Bottom Layer

## Text on the board
Bottom Silkscreen Layer: 5V | GND | PA8 | TX | RX | PB0 | 3V3 | PB1 | 吕俊霆2024270901009 | 宋翌博2024120904016 | 陈锐2024010801011
Top Silkscreen Layer: ON | OFF
